# Altium schematic sheet 05. UART.SchDoc
size A4; CheckedBy: 黄钦宁; Author: 陈坤; DocumentNumber: 5; SheetNumber: 5; SheetTotal: 13; PageSetup: Record=PageOptions|CenterHorizontal=True|CenterVertical=True|PrintScale=1.00|XCorrection=1.00|YCorrection=1.00|PrintKind=0|BorderSize=5000000|LeftOffset=0|BottomOffset=0|Orientation=2|PaperLength=1000|PaperWidth=1000|Scale=100|PaperSource=7|PrintQuality=600|MediaType=1|DitherType=10|PaperKind=A4|PrintScaleMode=1; DesignDate: 2013-08-16; CheckDate: 2013-12-28; SheetName: UART; SheetVersion: V1.00; SheetDescription: 调试串口和应用串口; ProductName: EasyARM-iMX28学习套件; ProductModel: EasyARM-iMX283
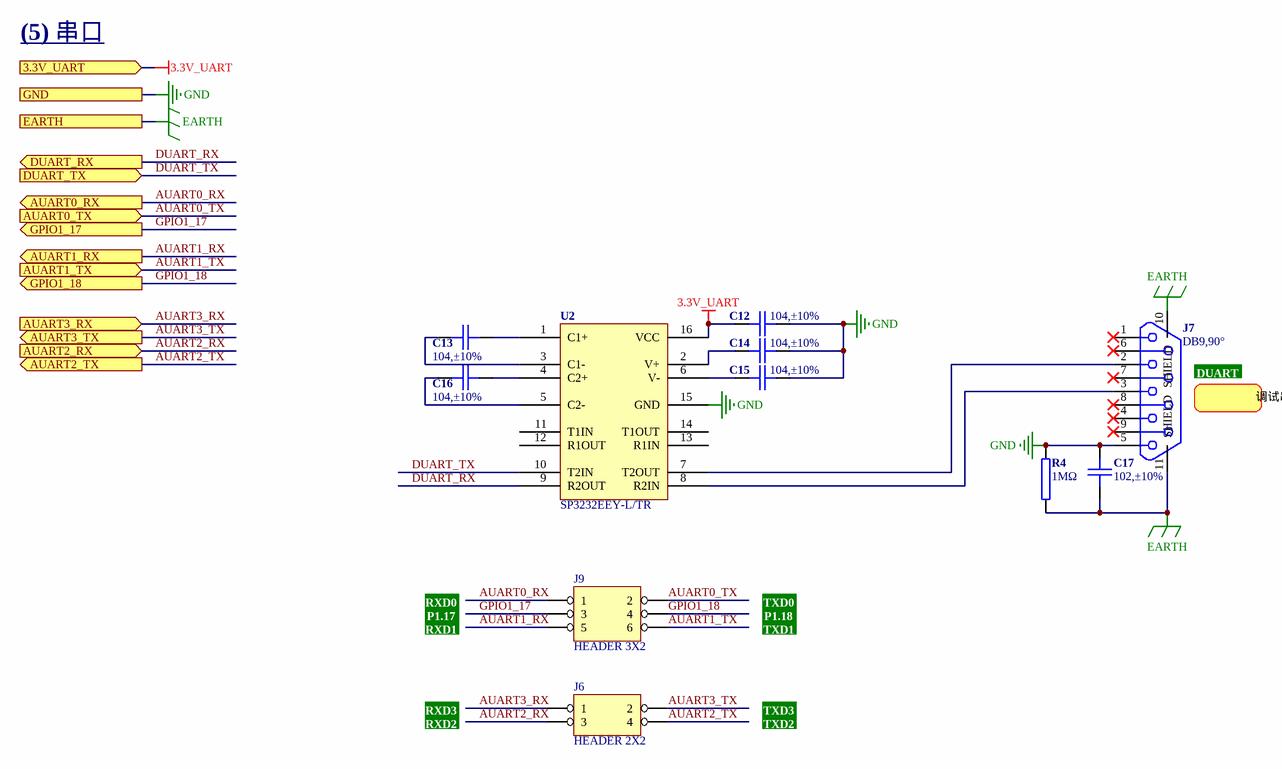
[diagram p0: 05. UART.SchDoc]

## Parts
C12  104,±10%  [0603C]
C13  104,±10%  [0603C]
C14  104,±10%  [0603C]
C15  104,±10%  [0603C]
C16  104,±10%  [0603C]
C17  102,±10%  [1206C]
J6  HEADER 2X2  [IDC-4]
J7  value DB9,90°  [DB-9RA/F]  (hidden comment: DB9)
J9  HEADER 3X2  [IDC-6]
R4  1MΩ  [1206R]
U2  value SP3232EEY-L/TR  [SOP65P640X120-16N]  (hidden comment: SP3232E)

## Ports
3.3V_UART, AUART0_RX (out), AUART0_TX (in), AUART1_RX (out), AUART1_TX (in), AUART2_RX (in), AUART2_TX (out), AUART3_RX (in), AUART3_TX (out), DUART_RX (out), DUART_TX (in), EARTH, GND, GPIO1_17 (out), GPIO1_18 (out)

## Nets
3.3V_UART: C12.1 U2.16(VCC) ; port 3.3V_UART
EARTH: C17.2 J7.10(SHIELD) J7.11(SHIELD) R4.1 ; port EARTH
GND: C12.2 C14.2 C15.2 C17.1 J7.5 R4.2 U2.15(GND) ; port GND
AUART0_RX: J9.1 ; port AUART0_RX
AUART0_TX: J9.2 ; port AUART0_TX
AUART1_RX: J9.5 ; port AUART1_RX
AUART1_TX: J9.6 ; port AUART1_TX
AUART2_RX: J6.3 ; port AUART2_RX
AUART2_TX: J6.4 ; port AUART2_TX
AUART3_RX: J6.1 ; port AUART3_RX
AUART3_TX: J6.2 ; port AUART3_TX
DUART_RX: U2.9(R2OUT) ; port DUART_RX
DUART_TX: U2.10(T2IN) ; port DUART_TX
GPIO1_17: J9.3 ; port GPIO1_17
GPIO1_18: J9.4 ; port GPIO1_18
NetC13_1: C13.1 U2.3(C1-)
NetC13_2: C13.2 U2.1(C1+)
NetC14_1: C14.1 U2.2(V+)
NetC15_1: C15.1 U2.6(V-)
NetC16_1: C16.1 U2.5(C2-)
NetC16_2: C16.2 U2.4(C2+)
NetJ7_2: J7.2 U2.7(T2OUT)
NetJ7_3: J7.3 U2.8(R2IN)

Not connected (* = marked no-connect by the designer): J7 1* 4* 6* 7* 8* 9*; U2 11(T1IN) 12(R1OUT) 13(R1IN) 14(T1OUT)

## Notes on the sheet
- (5) 串口
- (near J7) DUART
- 调试串口
- RXD0
- P1.17
- RXD1
- TXD0
- P1.18
- TXD1
- RXD3
- RXD2
- TXD3
- TXD2
- 1
- #
- 修改日期
- 修改内容
- 2
- 3
- 广州致远电子股份有限公司
- 设计人员
- 审核人员
- 设计日期
- 审核日期
- 产品名称
- 图纸名称
- 产品型号
- 图纸描述
- 图纸版本
- A4

## Library data of the parts
C12-C16 = 1.02.01.0032: 104,±10%,50V,X7R,0603,*,RoHS; 名称: 电容; 封装: 0603; 设备封装名称: C0603_104_X7R_50V_10%; 贴片和直插: SMT; 物料代码: 1.02.01.0032; Value: 104,±10%; RoHS: RoHS; 型号: 104,±10%,50V,X7R; ComponentLink1Description: ErpDataInfo; ComponentLink1URL: http://erp.zlgmcu.com/ErpExt/ErpData/ListMateriel.aspx?pkey=1.02.01.0032
C17 = 1.02.03.0003: 102,±10%,2KV,X7R,1206,*,RoHS; 名称: 电容; 封装: 1206; 设备封装名称: C1206_102_X7R_2KV_10%; 贴片和直插: SMT; 物料代码: 1.02.03.0003; Value: 102,±10%; RoHS: RoHS; 型号: 102,±10%,2KV,X7R; ComponentLink1Description: ErpDataInfo; ComponentLink1URL: http://erp.zlgmcu.com/ErpExt/ErpData/ListMateriel.aspx?pkey=1.02.03.0003
J7 = 1.10.05.0014: DB9,90°,孔,铆合,带螺丝; 名称: 串口座; 贴片和直插: THT; 物料代码: 1.10.05.0014; 型号: DB9,90°,孔,铆合,带螺丝; ComponentLink1Description: ErpDataInfo; ComponentLink1URL: http://erp.zlgmcu.com/ErpExt/ErpData/ListMateriel.aspx?pkey=1.10.05.0014
R4 = 1.01.03.0019: 1MΩ,1206,RoHS; 名称: 电阻; 封装: 1206; 设备封装名称: R1206_1M; 贴片和直插: SMT; 物料代码: 1.01.03.0019; Value: 1MΩ; RoHS: RoHS; 型号: 1MΩ; ComponentLink1Description: ErpDataInfo; ComponentLink1URL: http://erp.zlgmcu.com/ErpExt/ErpData/ListMateriel.aspx?pkey=1.01.03.0019
U2 = 1.05.08.0024: SP3232EEY-L/TR,TSSOP-16,EXAR,RoHS; 名称: IC; 设备封装名称: TSSOP-16_SP3232EEY-L/TR; 贴片和直插: SMT; 物料代码: 1.05.08.0024; 封装: TSSOP-16; 厂商: EXAR; RoHS: RoHS; 型号: SP3232EEY-L/TR; ComponentLink1Description: ErpDataInfo; ComponentLink1URL: http://erp.zlgmcu.com/ErpExt/ErpData/ListMateriel.aspx?pkey=1.05.08.0024